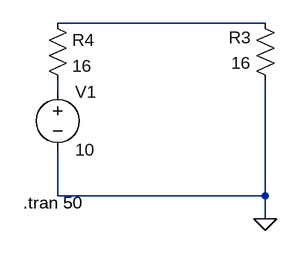
[diagram p0: schematic take4example5.asc]
take4example5.asc, the LTspice schematic file:
Version 4
SHEET 1 880 680
WIRE 400 32 112 32
WIRE 112 128 112 112
WIRE 112 272 112 208
WIRE 400 272 400 112
WIRE 400 272 112 272
WIRE 400 304 400 272
FLAG 400 304 0
SYMBOL res 416 128 R180
WINDOW 0 36 76 Left 2
WINDOW 3 36 40 Left 2
SYMATTR InstName R3
SYMATTR Value 16
SYMBOL res 96 16 R0
SYMATTR InstName R4
SYMATTR Value 16
SYMBOL voltage 112 112 R0
WINDOW 123 0 0 Left 2
WINDOW 39 0 0 Left 2
SYMATTR InstName V1
SYMATTR Value 10
TEXT 64 282 Left 2 !.tran 50

The netlist it stands for:
* take4example5.asc
R3 0 N001 16
R4 N001 N002 16
V1 N002 0 10
.tran 50
.backanno
.end